# EAGLE design SNES_SCIC_IGR_D4 (EAGLE 7.2.0)
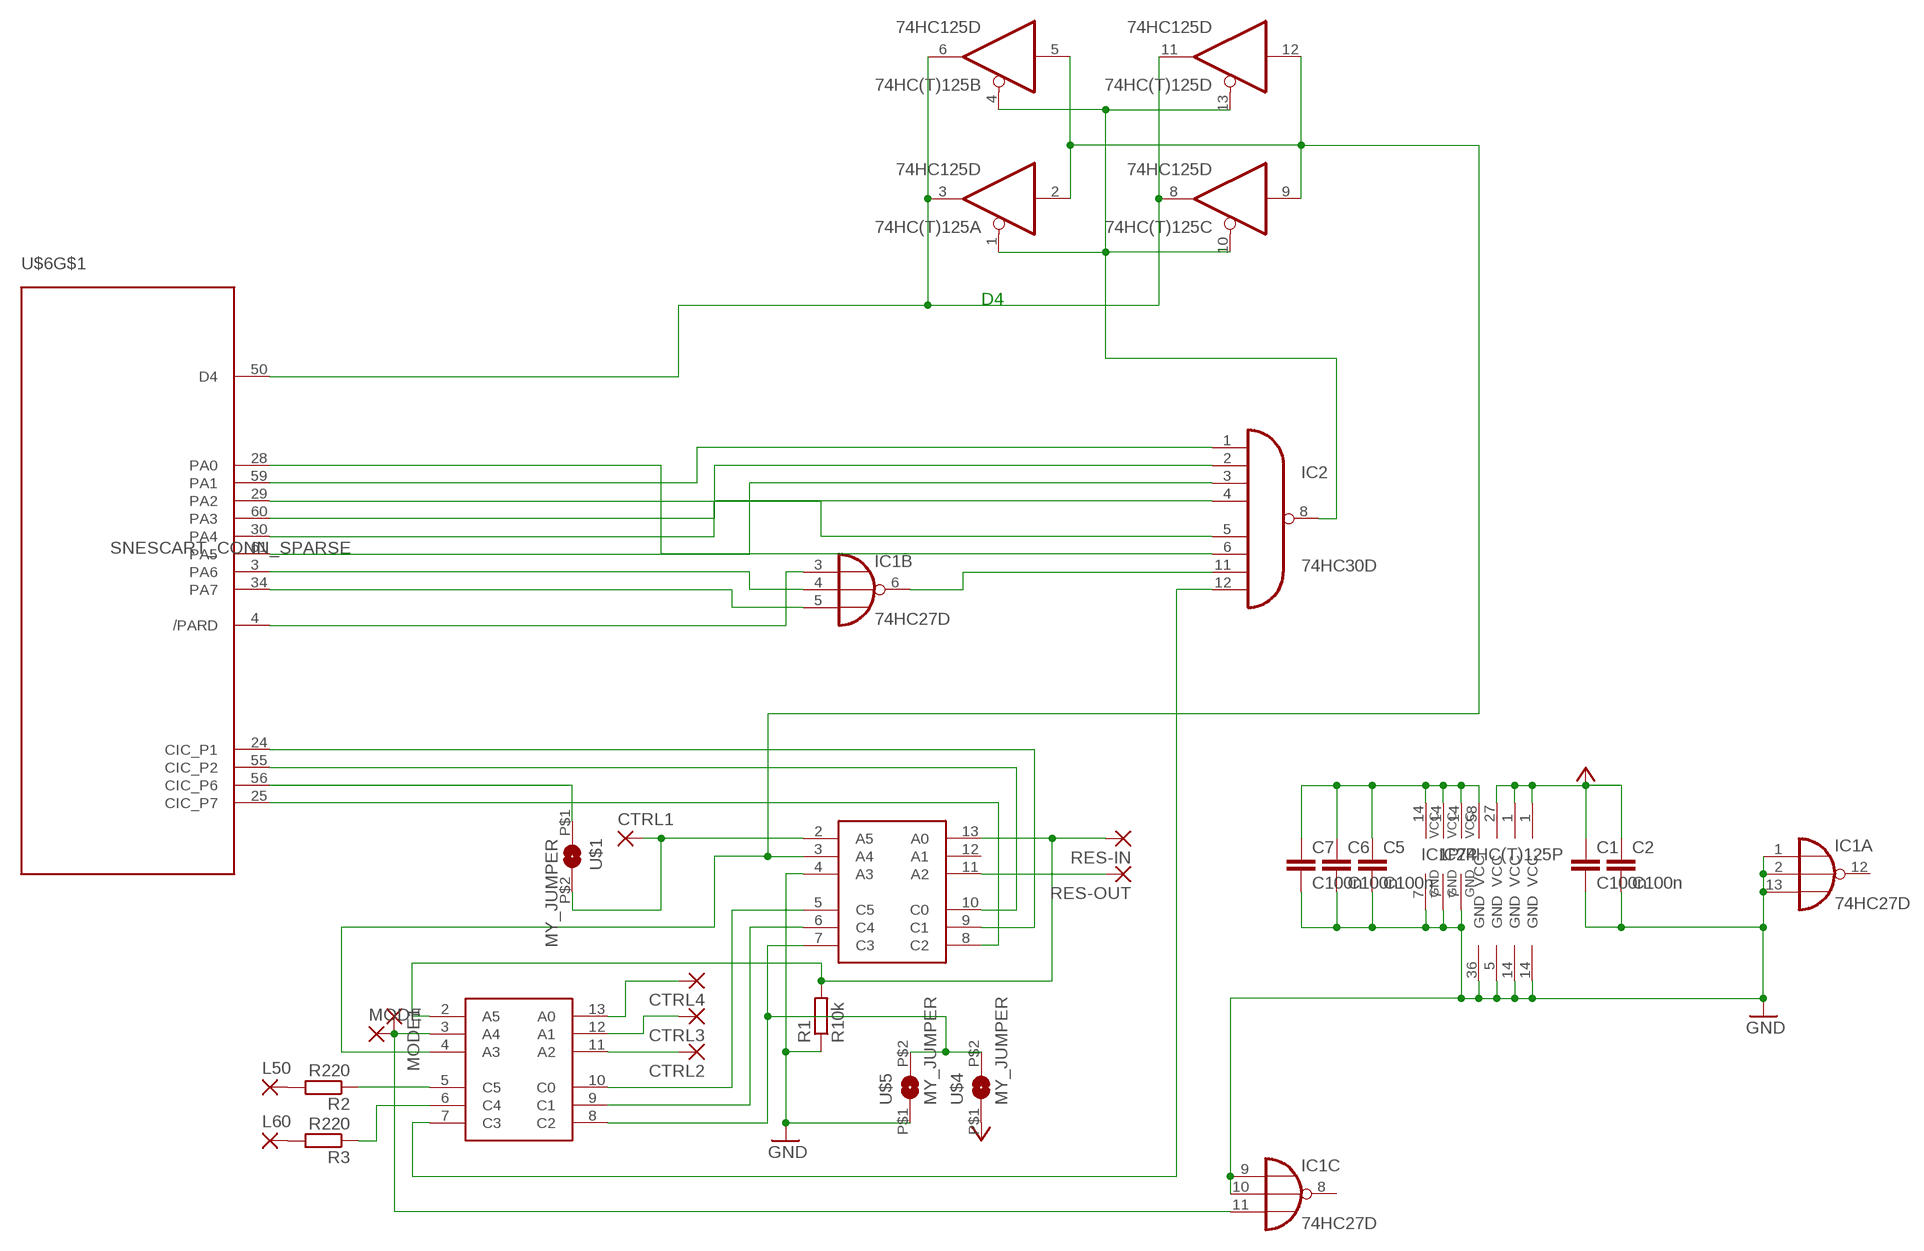
[diagram p0: schematic, sheet 1]

## Parts
74HC(T)125  74HC125D  [SO14]
C1  C100n  C0805  [Z0805]
C2  C100n  C0805  [Z0805]
C5  C100n  C0805  [Z0805]
C6  C100n  C0805  [Z0805]
C7  C100n  C0805  [Z0805]
CTRL1  SMD2  [SMD1,27-2,54]
CTRL2  SMD2  [SMD1,27-2,54]
CTRL3  SMD2  [SMD1,27-2,54]
CTRL4  SMD2  [SMD1,27-2,54]
IC1  74HC27D  [SO14]
IC2  74HC30D  [SO14]
L50  SMD2  [SMD1,27-2,54]
L60  SMD2  [SMD1,27-2,54]
MODE  SMD2  [SMD1,27-2,54]
MODE1  SMD2  [SMD1,27-2,54]
R1  R10k  R0805  [Z0805]
R2  R220  R0805  [Z0805]
R3  R220  R0805  [Z0805]
RES-IN  SMD2  [SMD1,27-2,54]
RES-OUT  SMD2  [SMD1,27-2,54]
U$1  MY_JUMPER  [MYJUMP]
U$2  PIC16F630_SIMPLE  [PIC16F630]
U$3  PIC16F630_SIMPLE  [PIC16F630]
U$4  MY_JUMPER  [MYJUMP]
U$5  MY_JUMPER  [MYJUMP]
U$6  SNESCART_CONN_SPARSE  [SNESCART_CONN_SPARSE]

## Nets
GND: 74HC(T)125.7(P:GND) C1.2 C2.2 C5.2 C6.2 C7.2 IC1.1(A:I0) IC1.2(A:I1) IC1.7(P:GND) IC1.9(C:I0) IC1.10(C:I1) IC1.13(A:I2) IC2.7(GND) R1.1 U$2.4(A3) U$2.14(GND) U$3.14(GND) U$5.P$1 U$6.5(GND) U$6.36(GND)
N$2: 74HC(T)125.1(A:OE) 74HC(T)125.4(B:OE) 74HC(T)125.10(C:OE) 74HC(T)125.13(D:OE) IC2.8(O)
N$3: RES-OUT.1(P) U$2.11(A2)
N$4: IC2.3(I2) U$6.61(PA5)
N$5: IC2.2(I1) U$6.60(PA3)
N$6: IC1.3(B:I0) U$6.4(/PARD)
N$7: IC1.4(B:I1) U$6.3(PA6)
N$8: IC1.6(B:O) IC2.11(I6)
N$9: IC2.6(I5) U$6.28(PA0)
N$10: R1.2 RES-IN.1(P) U$2.13(A0) U$3.2(A5)
N$11: L50.1(P) R2.2
N$12: R2.1 U$3.5(C5)
N$13: R3.1 U$3.6(C4)
N$14: IC1.11(C:I2) MODE1.1(P) MODE.1(P) U$3.3(A4)
N$15: L60.1(P) R3.2
N$16: IC1.5(B:I2) U$6.34(PA7)
N$17: IC2.12(I7) U$3.7(C3)
N$18: U$1.P$1 U$6.56(CIC_P6)
N$19: U$2.5(C5) U$3.10(C0)
N$20: IC2.1(I0) U$6.59(PA1)
N$21: IC2.5(I4) U$6.29(PA2)
N$22: IC2.4(I3) U$6.30(PA4)
N$33: CTRL2.1(P) U$3.11(A2)
N$34: CTRL3.1(P) U$3.12(A1)
N$39: CTRL1.1(P) U$1.P$2 U$2.2(A5)
N$42: 74HC(T)125.3(A:O) 74HC(T)125.6(B:O) 74HC(T)125.8(C:O) 74HC(T)125.11(D:O) U$6.50(D4)
N$46: CTRL4.1(P) U$3.13(A0)
N$48: U$2.10(C0) U$6.55(CIC_P2)
N$49: U$2.9(C1) U$6.24(CIC_P1)
N$51: U$2.8(C2) U$6.25(CIC_P7)
N$52: U$2.6(C4) U$3.9(C1)
N$53: U$2.7(C3) U$3.8(C2) U$4.P$2 U$5.P$2
UIGR: 74HC(T)125.2(A:I) 74HC(T)125.5(B:I) 74HC(T)125.9(C:I) 74HC(T)125.12(D:I) U$2.3(A4) U$3.4(A3)
VCC: C1.1 C2.1 U$2.1(VCC) U$3.1(VCC) U$4.P$1 U$6.27(VCC)
VCC_2: 74HC(T)125.14(P:VCC) C5.1 C6.1 C7.1 IC1.14(P:VCC) IC2.14(VCC) U$6.58(VCC)
Unconnected: IC1.8(C:O) IC1.12(A:O) U$2.12(A1)

## Notes on the sheet
- D4

## Library data of the parts
74HC(T)125 = 74xx-eu:74*125: Quad bus BUFFER, 3-state
C1 C2 C5-C7 = snescart:C0805
CTRL1-CTRL4 L50 L60 MODE MODE1 RES-IN RES-OUT = wirepad:SMD2: SMD PAD
IC1 = 74xx-eu:74*27: Triple 3-input NOR gate
IC2 = 74xx-eu:74*30: 8-input NAND gate
R1-R3 = snescart:R0805
U$1 U$4 U$5 = snescart:MY_JUMPER
U$2 U$3 = snescart:PIC16F630_SIMPLE
U$6 = snes_div:SNESCART_CONN_SPARSE

## Board
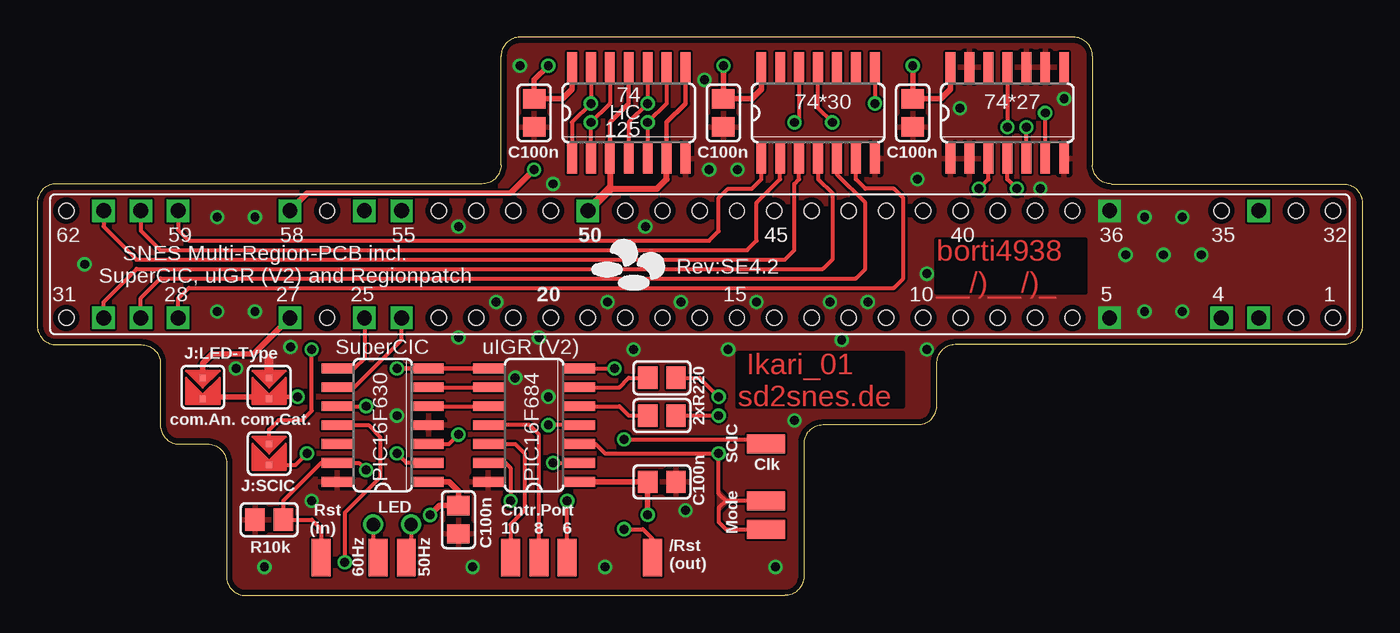
[diagram p1: board, top side]
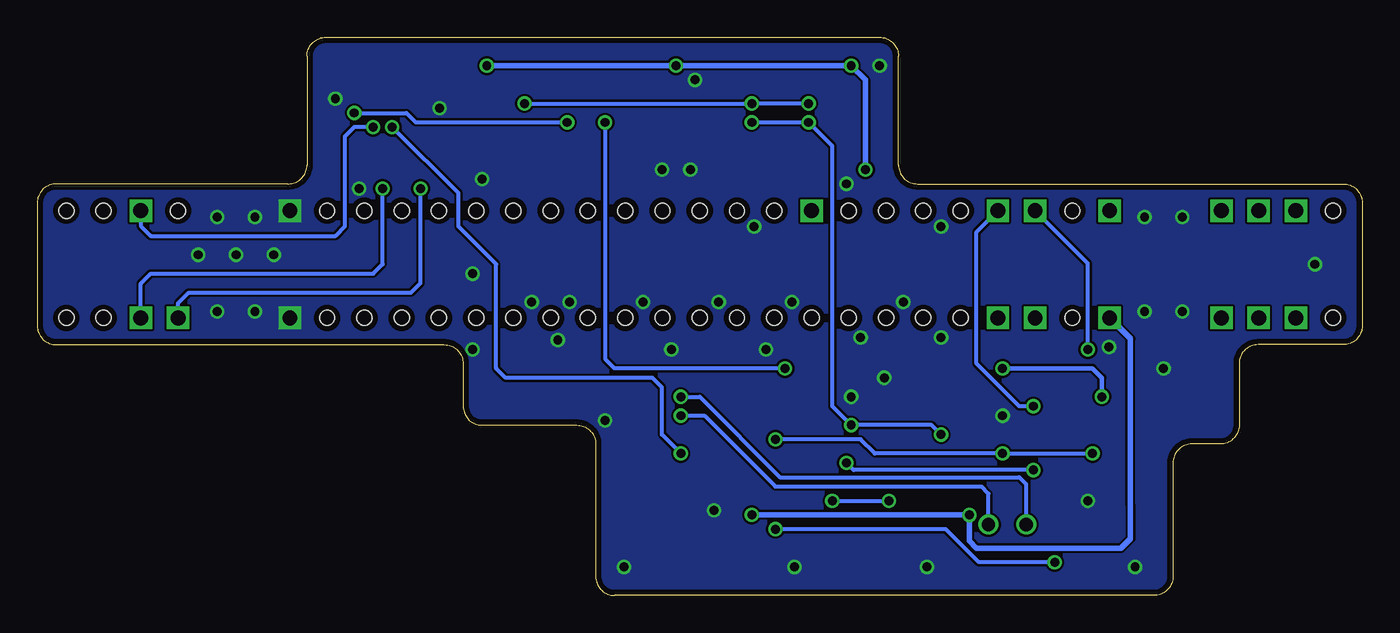
[diagram p2: board, bottom side, seen from below]

Size 88.9 x 37.47 mm. Coordinates in mm from the lower left corner, seen from the top.
Outline: 72.07,27.62 arc-90 70.8,28.89 70.8,36.19 arc90 69.53,37.47 32.38,37.47 arc90 31.11,36.19 31.11,28.89 arc-90 29.84,27.62 1.27,27.62 arc90 0,26.35 0,18.1 arc90 1.27,16.83 6.99,16.83 arc-90 8.26,15.56 8.26,11.43 arc90 9.53,10.16 11.43,10.16 arc-90 12.7,8.89 12.7,1.27 arc90 13.97,0 50.16,0 arc90 51.43,1.27 51.43,10.16 arc-90 52.7,11.43 59.05,11.43 arc90 60.32,12.7 60.32,15.56 arc-90 61.59,16.83 87.63,16.83 arc90 88.9,18.1 88.9,26.35 arc90 87.63,27.62 72.07,27.62
Copper layers (1*16): Top 0.0356mm / dielectric 1.5011mm / Bottom 0.0356mm
Design rules "LaenPCBOrder": minimum track width 6mil, minimum drill 13mil, track to track 6mil, track to pad 6mil, pad to pad 6mil, via to via 6mil, smd to smd 6mil, copper to edge 15mil, drill to drill 6mil, minimum pad ring 7mil, minimum via ring 7mil, stop-mask expansion 3mil, vias tented up to drill 0mil, thermal gap 10mil
tRestrict: 3 lines

### Footprints (pad centres in the part's own frame; a part is rotated, then mirrored left to right if it is on the bottom)
SO14 = smd 0.66 x 2.032: 1 -3.81,-3.073; 2 -2.54,-3.073; 3 -1.27,-3.073; 4 0,-3.073; 5 1.27,-3.073; 6 2.54,-3.073; 7 3.81,-3.073; 8 3.81,3.073; 9 2.54,3.073; 10 1.27,3.073; 11 0,3.073; 12 -1.27,3.073; 13 -2.54,3.073; 14 -3.81,3.073
Z0805 = smd 1.3 x 1.5: 1 -0.95,0; 2 0.95,0
SMD1,27-2,54 = smd 1.27 x 2.54: 1 0,0
MYJUMP = smd 0.406 x 0.406: P$1 -0.635,0; P$2 0.765,0
PIC16F630 = smd 0.66 x 2.032: 1 -3.81,-3.073; 2 -2.54,-3.073; 3 -1.27,-3.073; 4 0,-3.073; 5 1.27,-3.073; 6 2.54,-3.073; 7 3.81,-3.073; 8 3.81,3.073; 9 2.54,3.073; 10 1.27,3.073; 11 0,3.073; 12 -1.27,3.073; 13 -2.54,3.073; 14 -3.81,3.073
SNESCART_CONN_SPARSE = drill 1 square: 3 -3.6,-37.5; 4 -3.6,-35; 5 -3.6,-27.5; 24 -3.6,20; 25 -3.6,22.5; 27 -3.6,27.5; 28 -3.6,35; 29 -3.6,37.5; 30 -3.6,40; 34 3.6,-37.5; 36 3.6,-27.5; 50 3.6,7.5; 55 3.6,20; 56 3.6,22.5; 58 3.6,27.5; 59 3.6,35; 60 3.6,37.5; 61 3.6,40 | hole 1: -3.6,-42.5; -3.6,-40; -3.6,-25; -3.6,-22.5; -3.6,-20; -3.6,-17.5; -3.6,-15; -3.6,-12.5; -3.6,-10; -3.6,-7.5; -3.6,-5; -3.6,-2.5; -3.6,0; -3.6,2.5; -3.6,5; -3.6,7.5; -3.6,10; -3.6,12.5; -3.6,15; -3.6,17.5; -3.6,25; -3.6,42.5; 3.6,42.5; 3.6,25; 3.6,17.5; 3.6,15; 3.6,12.5; 3.6,10; 3.6,5; 3.6,2.5; 3.6,0; 3.6,-2.5; 3.6,-5; 3.6,-7.5; 3.6,-10; 3.6,-12.5; 3.6,-15; 3.6,-17.5; 3.6,-20; 3.6,-22.5; 3.6,-25; 3.6,-35; 3.6,-40; 3.6,-42.5

### Placement (x,y rotation side)
74HC(T)125  39.69,32.39 0 top
C1  41.91,7.62 0 top
C2  28.26,5.08 270 top
C5  33.34,32.39 270 top
C6  46.04,32.39 270 top
C7  58.74,32.39 270 top
CTRL1  48.89,10.16 90 top
CTRL2  33.65,2.54 0 top
CTRL3  31.75,2.54 0 top
CTRL4  35.56,2.54 0 top
IC1  65.09,32.39 0 top
IC2  52.39,32.39 0 top
L50  24.77,2.54 0 top
L60  22.86,2.54 0 top
MODE  48.89,4.45 90 top
MODE1  48.89,6.35 90 top
R1  15.56,5.08 0 top
R2  41.91,12.07 0 top
R3  41.91,14.61 0 top
RES-IN  19.05,2.54 0 top
RES-OUT  41.27,2.54 180 top
U$1  15.56,9.53 270 top
U$2  23.18,11.43 90 top
U$3  33.34,11.43 90 top
U$4  11.11,13.97 270 top
U$5  15.56,13.97 270 top
U$6  44.45,22.23 90 top

### Tracks (layer width: path | path; a pad name or v marks a point on that pad's centre or on a via)
GND  (via drill 0.6)
  Top 0.61: U$5.P$1 15.56,15.88
  other vias: 24.13,12.07 78.11,22.86 73.03,22.86 49.53,1.91 55.72,19.68 76.84,19.05 68.9,33.34 34.61,27.62 3.18,22.23 46.35,16.51 74.3,19.05 75.56,22.86 45.08,28.57 13.34,15.24 12.07,25.4 15.24,1.91 12.07,19.05 14.61,25.4 28.26,24.77 59.05,27.94 40,16.51 74.3,25.4 53.18,19.68 53.97,17.14 34.29,13.34 32.07,14.61 46.99,28.57 50.8,11.75 16.99,16.67 38.1,1.91 76.84,25.4 14.61,19.05 30.8,19.68 43.5,5.71 67.31,27.31 61.91,32.7 44.77,34.61 48.26,19.68 43.18,19.68 18.41,6.35 29.21,1.91 32.38,35.56 38.26,19.68 40.8,24.77 28.26,17.3 33.65,17.3 59.69,16.51 59.69,21.59
  pour Top (rank 2): -1.27,-5.71 90.17,-5.71 90.17,40 -1.27,40
  pour Bottom (rank 2): -1.27,40 90.17,40 90.17,-5.71 -1.27,-5.71
  pour Bottom (rank 2, no thermals): 69.85,27.31 73.66,27.31 73.66,17.3 69.85,17.3
  pour Top (rank 2, no thermals): 69.85,27.31 73.66,27.31 73.66,17.46 69.85,17.46
N$2  (via drill 0.6)
  Top 0.254: 74HC(T)125.13 v37.15,33.02 35.88,31.75 74HC(T)125.1 | 74HC(T)125.10 v40.96,33.02 39.69,31.75 74HC(T)125.4 | IC2.8 v56.2,33.02
  Bottom 0.254: v37.15,33.02 v40.96,33.02 v56.2,33.02
N$3  (via drill 0.6)
  Top 0.254: U$2.11 22.23,11.43 23.02,10.64 23.02,7.94 20.64,5.56 v20.64,2.22 | v39.37,4.45 40.64,4.45 41.27,3.81 RES-OUT.1
  Bottom 0.254: v20.64,2.22 25.72,2.22 27.94,4.45 v39.37,4.45
N$4
  Top 0.254: U$6.61 4.45,24.77 6.67,22.54 50.16,22.54 50.8,23.18 50.8,27.62 51.12,27.94 IC2.3
  Top 0.305: U$6.61
N$5
  Top 0.254: U$6.60 6.95,24.48 8.26,23.18 47.62,23.18 48.26,23.81 48.26,26.35 49.85,27.94 IC2.2
N$6  (via drill 0.6)
  Top 0.254: v63.18,27.31 63.82,27.94 IC1.3
  Bottom 0.254: U$6.4 79.45,19.61 78.74,20.32 63.82,20.32 63.18,20.96 v63.18,27.31
N$7  (via drill 0.6)
  Top 0.254: v65.72,27.31 65.09,27.94 IC1.4
  Bottom 0.254: U$6.3 81.95,20.92 81.28,21.59 66.36,21.59 65.72,22.23 v65.72,27.31
N$8  (via drill 0.6)
  Top 0.254: v53.34,31.75 52.39,32.7 IC2.11 | IC1.6 v67.63,32.39
  Bottom 0.254: v67.63,32.39 64.14,32.39 63.5,31.75 v53.34,31.75
N$9
  Top 0.254: U$6.28 9.45,19.93 10.16,20.64 57.47,20.64 58.1,21.27 58.1,26.67 57.47,27.31 55.56,27.31 54.93,27.94 IC2.6
N$10  (via drill 0.6)
  Top 0.254: RES-IN.1 19.05,4.45 18.41,5.08 R1.2 16.51,6.35 19.05,8.89 U$2.13 21.59,8.89 v22.07,8.41 | v34.61,8.89 U$3.2
  Bottom 0.254: v22.07,8.41 34.13,8.41 v34.61,8.89
N$11  (via drill 0.6, 0.9)
  Top 0.254: R2.2 v45.72,12.07 | v25.08,4.76 25.08,2.86 L50.1
  Bottom 0.254: v45.72,12.07 44.13,12.07 39.37,7.3 25.56,7.3 25.08,6.83 v25.08,4.76
N$12
  Top 0.254: U$3.5 39.05,12.7 39.69,12.07 R2.1
N$13
  Top 0.254: U$3.6 39.05,13.97 39.69,14.61 R3.1
N$14  (via drill 0.6)
  Top 0.254: U$3.3 37.46,10.16 38.1,9.53 v45.72,9.53 45.72,6.83 46.2,6.35 | IC1.11 v65.09,31.43 | 46.2,6.35 45.72,5.87 45.72,4.92 46.2,4.45 MODE.1 | MODE1.1 46.2,6.35
  Bottom 0.254: v65.09,31.43 60.64,26.99 60.64,24.77 58.1,22.23 58.1,15.24 57.47,14.61 47.62,14.61 46.99,13.97 46.99,10.8 v45.72,9.53
  pour Top: 45.72,6.98 45.72,5.71 46.35,6.35
N$15  (via drill 0.6, 0.9)
  Top 0.254: R3.2 44.45,14.61 v45.72,13.34 | v22.54,4.76 22.54,2.86 L60.1
  Bottom 0.254: v45.72,13.34 44.45,13.34 39.05,7.94 23.02,7.94 22.54,7.46 v22.54,4.76
N$16  (via drill 0.6)
  Top 0.254: IC1.5 v66.36,31.43
  Bottom 0.254: v66.36,31.43 67.63,31.43 68.26,30.8 68.26,24.77 68.9,24.13 81.28,24.13 81.95,24.8 U$6.34
N$17  (via drill 0.6)
  Top 0.254: U$3.7 v38.73,15.24 | IC2.12 51.12,32.07 v50.8,31.75
  Bottom 0.254: v38.73,15.24 50.16,15.24 50.8,15.88 v50.8,31.75
N$18  (via drill 0.6)
  Top 0.254: U$1.P$1 15.56,11.11 16.19,11.75 17.78,11.75 18.41,12.38 v18.41,16.51
  Bottom 0.254: v18.41,16.51 18.41,22.29 U$6.56
N$19
  Top 0.254: U$2.5 U$3.10
N$20
  Top 0.254: U$6.59 9.45,24.52 10.16,23.81 45.08,23.81 45.72,24.45 45.72,26.67 46.35,27.31 47.94,27.31 48.58,27.94 IC2.1
N$21
  Top 0.254: U$6.29 6.95,19.97 8.26,21.27 54.93,21.27 55.56,21.91 55.56,26.35 53.66,28.26 IC2.5
N$22
  Top 0.254: U$6.30 4.45,19.69 6.67,21.91 52.7,21.91 53.34,22.54 53.34,26.99 52.39,27.94 IC2.4
N$33
  Top 0.254: CTRL2.1 33.65,10.8 33.02,11.43 U$3.11
N$34
  Top 0.254: U$3.12 32.07,10.16 32.7,9.53 32.7,5.71 31.75,4.76 CTRL3.1
N$39  (via drill 0.6)
  Top 0.254: U$2.2 24.77,8.89 v24.13,9.53 | U$1.P$2 17.33,8.76 v18.1,9.53 | v39.37,10.48 48.58,10.48 CTRL1.1
  Bottom 0.254: v18.1,9.53 v24.13,9.53 32.7,9.53 33.65,10.48 v39.37,10.48
N$42
  Top 0.305: 74HC(T)125.3 38.42,31.75 39.69,33.02 74HC(T)125.11 | 74HC(T)125.6 42.23,31.75 43.5,33.02 74HC(T)125.8 43.5,35.24
  Top 0.406: 74HC(T)125.6 42.23,27.94 41.59,27.31 38.42,27.31 74HC(T)125.3
  Top 0.61: U$6.50 36.95,25.84 38.42,27.31
N$46  (via drill 0.6)
  Top 0.254: U$3.13 31.43,8.89 31.75,8.57 v31.75,6.35 | CTRL4.1 v35.56,6.35
  Bottom 0.254: v35.56,6.35 v31.75,6.35
N$48  (via drill 0.6)
  Top 0.254: U$2.10 v22.07,12.7
  Bottom 0.254: U$6.55 25.88,24.4 25.88,15.56 23.02,12.7 v22.07,12.7
N$49
  Top 0.254: U$2.9 21.27,13.97 24.45,17.14 U$6.24
N$51
  Top 0.254: U$6.25 21.95,15.92 21.27,15.24 U$2.8
N$52
  Top 0.254: U$2.6 U$3.9
N$53  (via drill 0.6)
  Top 0.305: U$2.7 v24.13,15.24 U$3.8 | v17.46,13.34 15.88,13.34 15.75,13.21 U$5.P$2 15.43,13.34 | U$4.P$2 11.3,13.21 11.43,13.34
  Top 0.356: 11.43,13.34 15.43,13.34
  Bottom 0.305: v24.13,15.24 18.1,15.24 17.46,14.61 v17.46,13.34
UIGR  (via drill 0.6)
  Top 0.254: U$3.4 v34.29,11.43 | 74HC(T)125.9 42.23,33.02 v40.96,31.75 74HC(T)125.5 | 74HC(T)125.2 v37.15,31.75 38.42,33.02 74HC(T)125.12 | U$2.3 27.62,10.16 v28.26,10.8
  Bottom 0.254: v28.26,10.8 28.89,11.43 v34.29,11.43 35.56,12.7 35.56,30.16 v37.15,31.75 v40.96,31.75
VCC  (via drill 0.6)
  Top 0.356: U$3.1 C1.1 v40.96,5.4 | U$2.1 27.62,7.62 28.26,6.98 C2.1 26.99,6.03 v26.35,5.4 | U$4.P$1 11.11,15.56 11.75,16.19 14.52,16.19 U$6.27
  Bottom 0.305: v40.96,5.4
  Bottom 0.356: U$6.27 15.56,17.23 15.56,6.03 15.56,3.81 16.19,3.18 25.88,3.18 26.35,3.65 v26.35,5.4 v40.96,5.4
VCC_2  (via drill 0.6)
  Top 0.305: U$6.58 16.95,25.84 | C7.1 | C5.1 | C6.1
  Top 0.356: 16.95,25.84 18.1,26.99 31.75,26.99 v33.34,28.57 | v58.74,35.56 C7.1 | IC1.14 61.28,33.97 60.64,33.34 C7.1 | IC2.14 48.58,33.97 47.94,33.34 C6.1 | 74HC(T)125.14 35.88,33.97 35.24,33.34 C5.1 33.34,34.61 v34.29,35.56 | C6.1 v46.04,35.56
  Bottom 0.356: v58.74,35.56 v46.04,35.56 v34.29,35.56 33.34,34.61 v33.34,28.57

### Text on the board
Top: borti4938 / __/)__/)_ | Ikari_01 / sd2snes.de
tNames: 74 / HC / 125 | 74*30 | 74*27 | C100n | C100n | C100n | SNES Multi-Region-PCB incl. / SuperCIC, uIGR (V2) and Regionpatch | Rev:SE4.2 | J:LED-Type | SuperCIC | uIGR (V2) | com.An. | com.Cat. | 2xR220 | SCIC | Clk | J:SCIC | PIC16F630 | PIC16F684 | LED | Rst / (in) | Cntr.Port / 10 | 8 | 6 | Mode | C100n | 60Hz | 50Hz | /Rst / (out)
tStop: b | o | r | t | i | 4 | 9 | 3 | 8 | _ | _ | / | ) | _ | _ | / | ) | _ | I | k | a | r | i | _ | 0 | 1 | s | d | 2 | s | n | e | s | . | d | e